# EAGLE design imu (EAGLE 9.5.0)
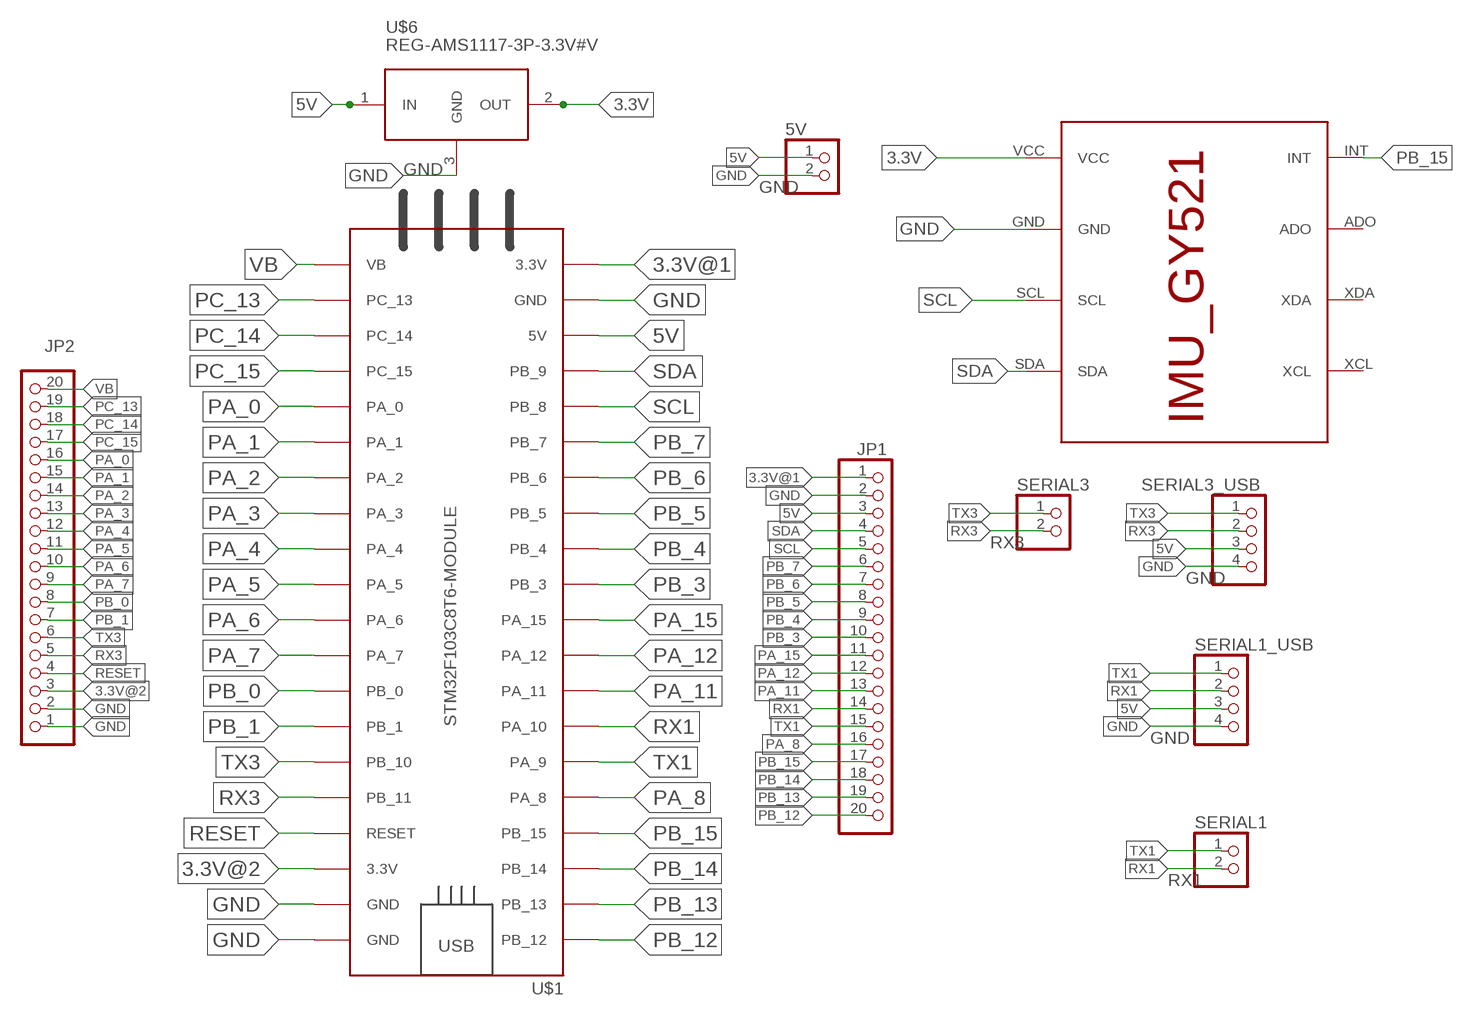
[diagram p0: schematic, sheet 1]

## Parts
5V  PINHD-2_DATA  [1X02_DATA]
JP1  PINHD-1X20  [1X20]
JP2  PINHD-1X20  [1X20]
SERIAL1  PINHD-2_DATA  [1X02_DATA]
SERIAL1_USB  PINHD-4_DATA  [1X04_DATA]
SERIAL3  PINHD-2_DATA  [1X02_DATA]
SERIAL3_USB  PINHD-4_DATA  [1X04_DATA]
U$1  STM32F103C8T6-MODULE  [STM32F103C8T6-MODULE]
U$2  IMU_ROBOCON_GY521  [IMU_GY521]
U$6  REG-AMS1117-3P-3.3V#V  [REG-AMS1117-3P#V]

## Nets
3.3V: U$2.VCC U$6.2(OUT)
3.3V@1: JP1.1 U$1.3.3V_1(3.3V)
3.3V@2: JP2.3 U$1.3.3V_2(3.3V)
5V: 5V.1 JP1.3 SERIAL1_USB.3 SERIAL3_USB.3 U$1.5V U$6.1(IN)
GND: 5V.2 JP1.2 JP2.1 JP2.2 SERIAL1_USB.4 SERIAL3_USB.4 U$1.GND_1(GND) U$1.GND_2(GND) U$1.GND_3(GND) U$2.GND U$6.3(GND)
PA_0: JP2.16 U$1.PA_0
PA_1: JP2.15 U$1.PA_1
PA_2: JP2.14 U$1.PA_2
PA_3: JP2.13 U$1.PA_3
PA_4: JP2.12 U$1.PA_4
PA_5: JP2.11 U$1.PA_5
PA_6: JP2.10 U$1.PA_6
PA_7: JP2.9 U$1.PA_7
PA_8: JP1.16 U$1.PA_8
PA_11: JP1.13 U$1.PA_11
PA_12: JP1.12 U$1.PA_12
PA_15: JP1.11 U$1.PA_15
PB_0: JP2.8 U$1.PB_0
PB_1: JP2.7 U$1.PB_1
PB_3: JP1.10 U$1.PB_3
PB_4: JP1.9 U$1.PB_4
PB_5: JP1.8 U$1.PB_5
PB_6: JP1.7 U$1.PB_6
PB_7: JP1.6 U$1.PB_7
PB_12: JP1.20 U$1.PB_12
PB_13: JP1.19 U$1.PB_13
PB_14: JP1.18 U$1.PB_14
PB_15: JP1.17 U$1.PB_15 U$2.INT
PC_13: JP2.19 U$1.PC_13
PC_14: JP2.18 U$1.PC_14
PC_15: JP2.17 U$1.PC_15
RESET: JP2.4 U$1.RESET
RX1: JP1.14 SERIAL1.2 SERIAL1_USB.2 U$1.PA_10
RX3: JP2.5 SERIAL3.2 SERIAL3_USB.2 U$1.PB_11
SCL: JP1.5 U$1.PB_8 U$2.SCL
SDA: JP1.4 U$1.PB_9 U$2.SDA
TX1: JP1.15 SERIAL1.1 SERIAL1_USB.1 U$1.PA_9
TX3: JP2.6 SERIAL3.1 SERIAL3_USB.1 U$1.PB_10
VB: JP2.20 U$1.VB
Unconnected: U$2.ADO U$2.XCL U$2.XDA

## Library data of the parts
5V SERIAL1 SERIAL3 = MIA_LIBRARY-2-2-2:PINHD-2_DATA: PIN HEADER
JP1 JP2 = MIA_LIBRARY-2-2-2:PINHD-1X20: PIN HEADER
SERIAL1_USB SERIAL3_USB = MIA_LIBRARY-2-2-2:PINHD-4_DATA: PIN HEADER
U$1 = MIA_LIBRARY-2-2-2:STM32F103C8T6-MODULE: STM32F103C8T6 module with ARM Cortex-3, 20kB SRAM, 64kB Flash, 72MHz
U$2 = MIA_LIBRARY-2-2-2:IMU_ROBOCON_GY521
U$6 = MIA_LIBRARY-2-2-2:REG-AMS1117-3P-*: Linear Regulator based on AMS1117 chip 3-pin version AMS1117 datasheet is available here: http://www.advanced-monolithic.com/pdf/ds1117.pdf Click here to find device on ebay.com <http://www.ebay.com/sch/ams1117+module> Note: There are many variants. Search for the proper version.

## Board
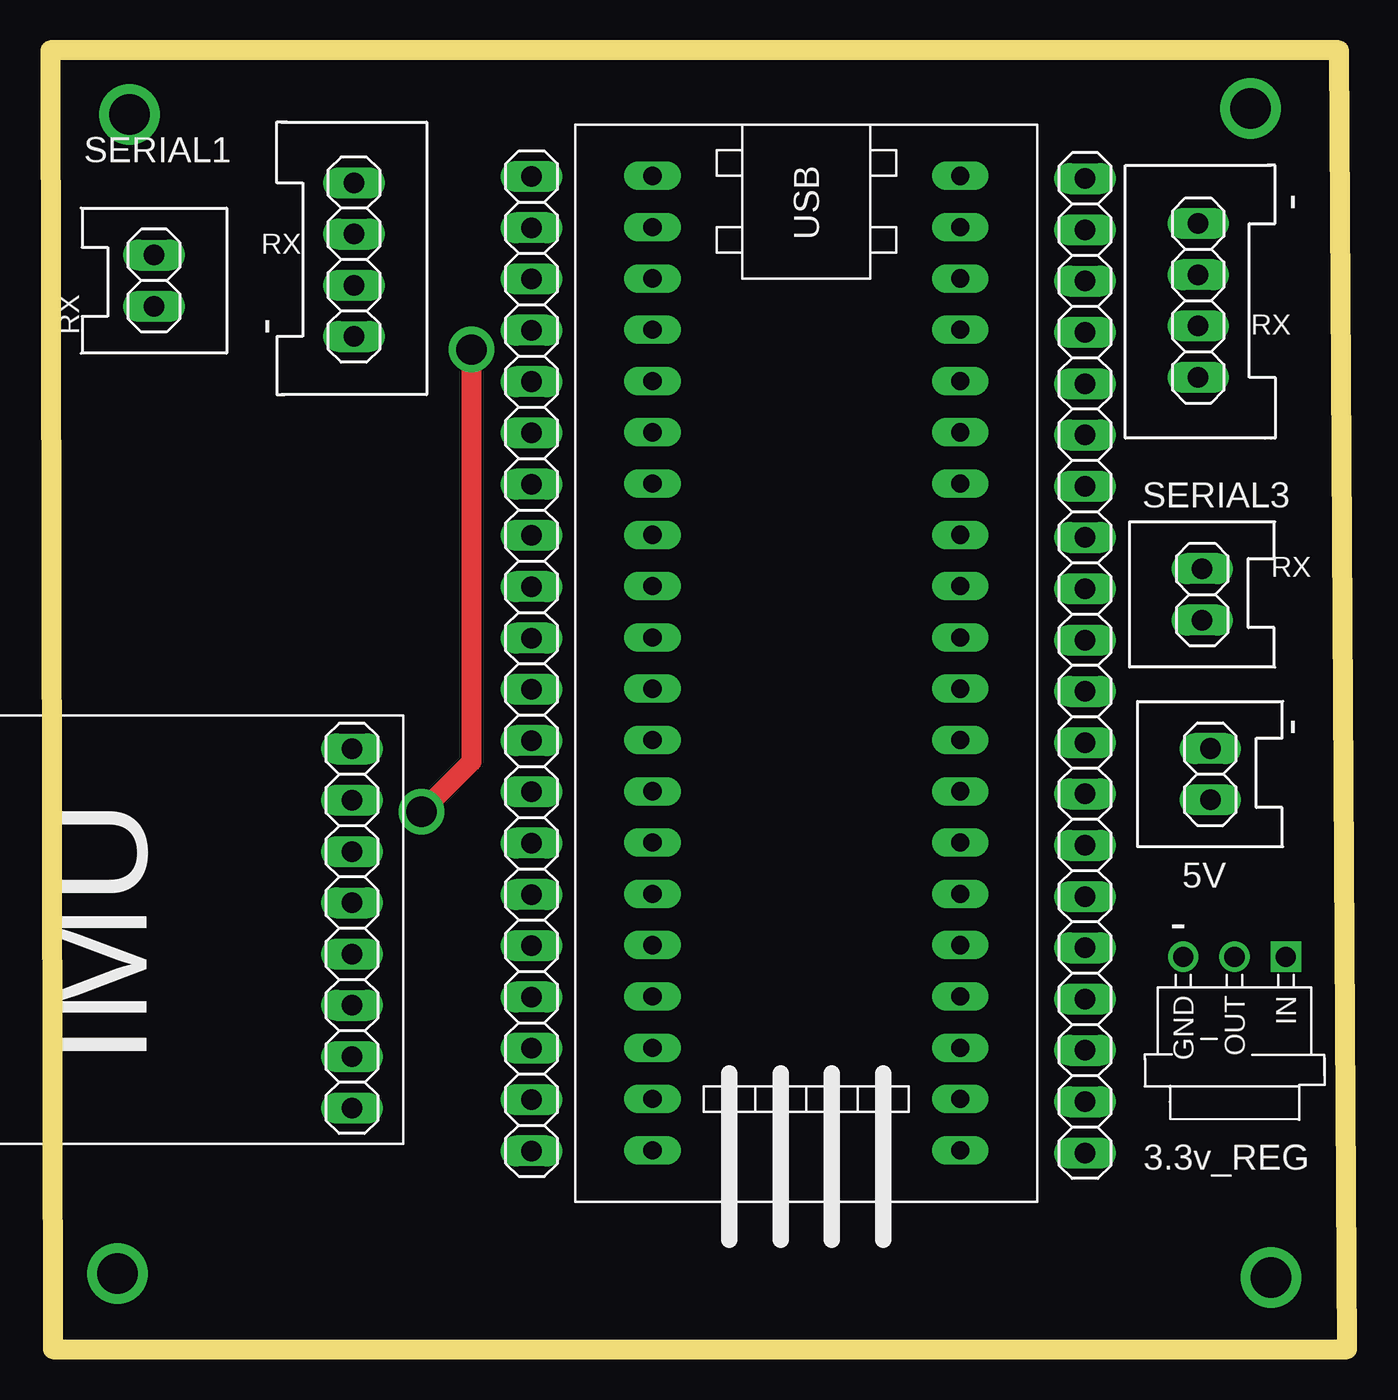
[diagram p1: board, top side]
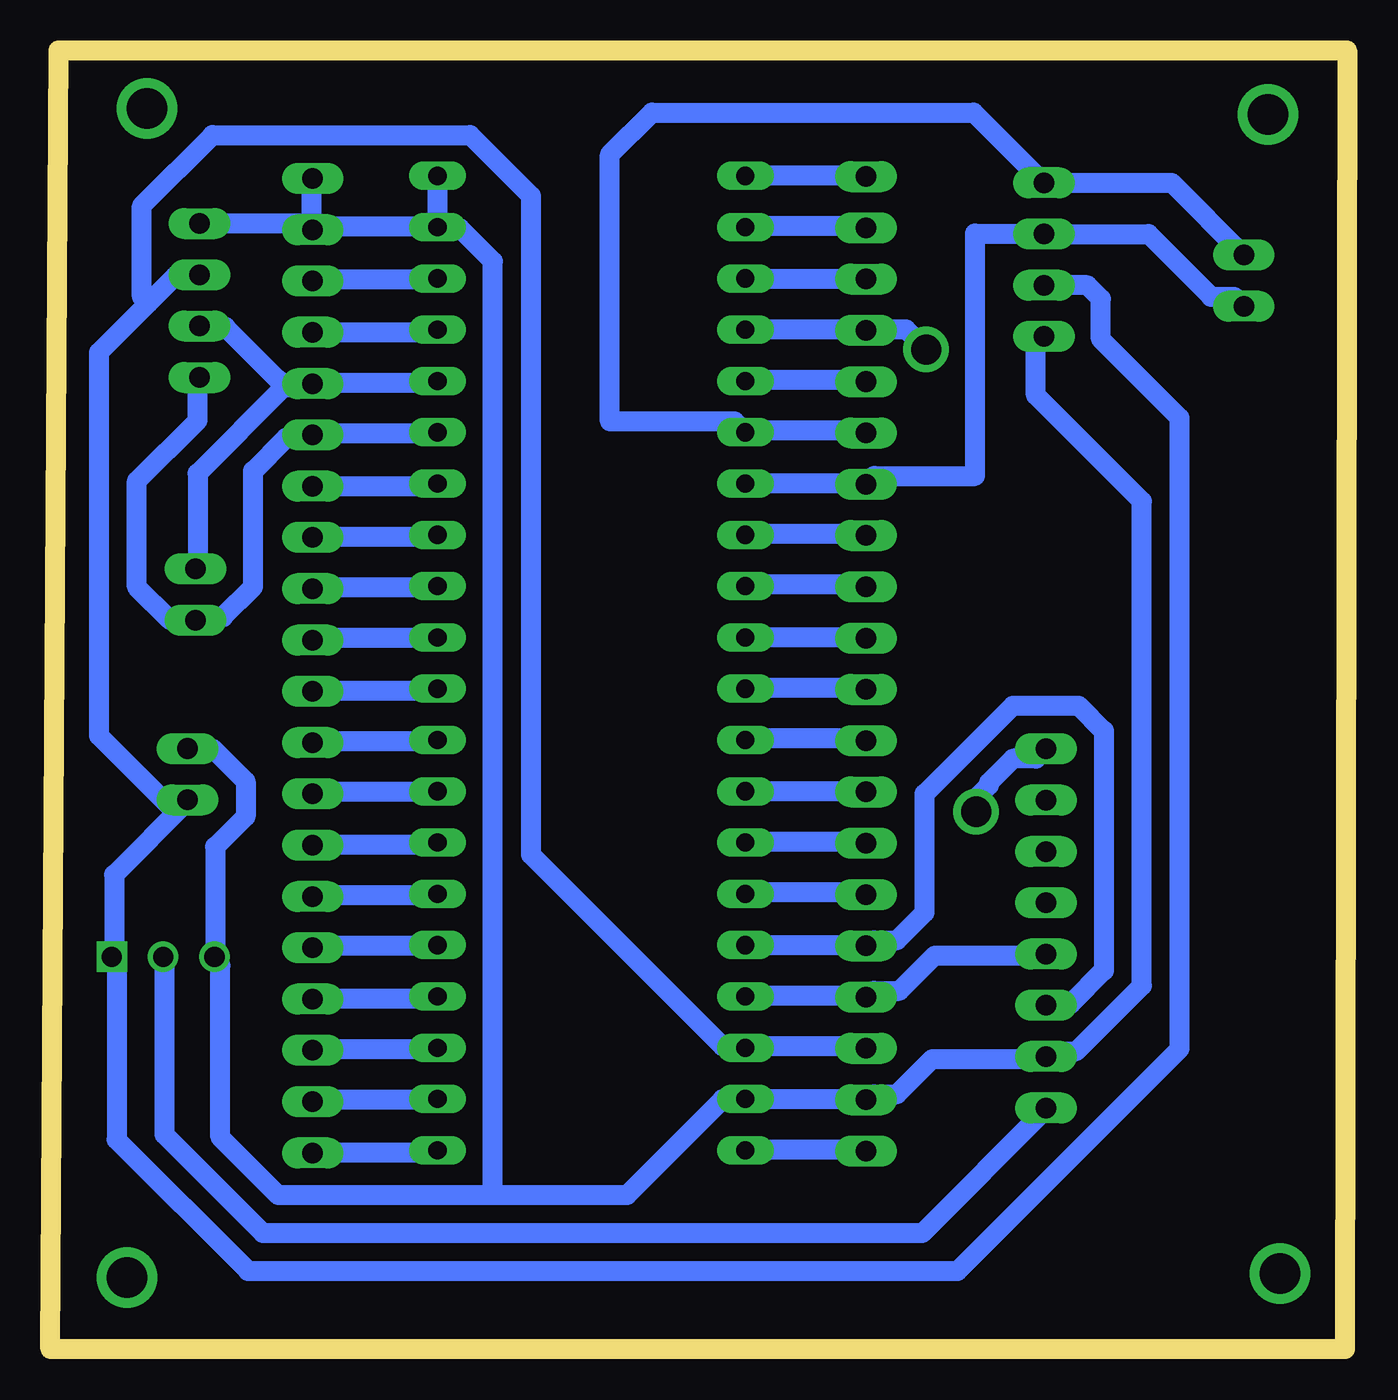
[diagram p2: board, bottom side, seen from below]

Size 64.2 x 64.31 mm. Coordinates in mm from the lower left corner, seen from the top.
Outline: 0.11,0 64.2,0 63.8,64.31 0,64.31 0.11,0
Copper layers (1*16): Top 0.035mm / dielectric 1.5mm / Bottom 0.035mm
Design rules "default *": minimum track width 1mm, minimum drill 0.35mm, track to track 0.8mm, track to pad 0.8mm, pad to pad 0.8mm, via to via 0.8mm, smd to smd 6mil, copper to edge 0.8mm, drill to drill 0.8mm, minimum pad ring 10mil, minimum via ring 8mil, stop-mask expansion 4mil, vias tented up to drill 0mil, thermal gap 10mil

### Footprints (pad centres in the part's own frame; a part is rotated, then mirrored left to right if it is on the bottom)
1X02_DATA = drill 1.016 long: 1 -1.27,0; 2 1.27,0
1X20 = drill 1.016 long: 1 -24.13,0; 2 -21.59,0; 3 -19.05,0; 4 -16.51,0; 5 -13.97,0; 6 -11.43,0; 7 -8.89,0; 8 -6.35,0; 9 -3.81,0; 10 -1.27,0; 11 1.27,0; 12 3.81,0; 13 6.35,0; 14 8.89,0; 15 11.43,0; 16 13.97,0; 17 16.51,0; 18 19.05,0; 19 21.59,0; 20 24.13,0
1X04_DATA = drill 1.016 long: 1 -3.81,0; 2 -1.27,0; 3 1.27,0; 4 3.81,0
STM32F103C8T6-MODULE = drill 0.9 long: 3.3V_1 25.4,-7.62; 3.3V_2 -17.78,7.62; 5V 20.32,-7.62; GND_1 22.86,-7.62; GND_2 -20.32,7.62; GND_3 -22.86,7.62; PA_0 15.24,7.62; PA_1 12.7,7.62; PA_2 10.16,7.62; PA_3 7.62,7.62; PA_4 5.08,7.62; PA_5 2.54,7.62; PA_6 0,7.62; PA_7 -2.54,7.62; PA_8 -12.7,-7.62; PA_9 -10.16,-7.62; PA_10 -7.62,-7.62; PA_11 -5.08,-7.62; PA_12 -2.54,-7.62; PA_15 0,-7.62; PB_0 -5.08,7.62; PB_1 -7.62,7.62; PB_3 2.54,-7.62; PB_4 5.08,-7.62; PB_5 7.62,-7.62; PB_6 10.16,-7.62; PB_7 12.7,-7.62; PB_8 15.24,-7.62; PB_9 17.78,-7.62; PB_10 -10.16,7.62; PB_11 -12.7,7.62; PB_12 -22.86,-7.62; PB_13 -20.32,-7.62; PB_14 -17.78,-7.62; PB_15 -15.24,-7.62; PC_13 22.86,7.62; PC_14 20.32,7.62; PC_15 17.78,7.62; RESET -15.24,7.62; VB 25.4,7.62
IMU_GY521 = drill 1.016 long: ADO -6.35,0; GND 6.35,0; INT -8.89,0; SCL 3.81,0; SDA 1.27,0; VCC 8.89,0; XCL -3.81,0; XDA -1.27,0
REG-AMS1117-3P#V = drill 1 square: 1 -2.54,-5.08 | drill 1: 2 0,-5.08; 3 2.54,-5.08

### Placement (x,y rotation side)
5V  57.42,28.47 90 top
JP1  23.82,33.94 90 top
JP2  51.22,33.84 270 top
SERIAL1  5.12,52.91 270 top
SERIAL1_USB  15.02,53.95 270 top
SERIAL3  57.02,37.37 90 top
SERIAL3_USB  56.82,51.93 90 top
U$1  37.42,35.24 270 top
U$2  14.92,20.83 270 top
U$6  58.62,14.34 180 top

### Tracks (layer width: path | path; a pad name or v marks a point on that pad's centre or on a via)
3.3V
  Bottom 1: U$6.2 58.55,19.37 58.55,10.62 53.67,5.74 21.05,5.74 14.92,11.87 U$2.VCC
3.3V@1
  Bottom 1: U$1.3.3V_1 29.8,9.87 23.92,9.87 JP1.1
3.3V@2
  Bottom 1: U$1.3.3V_2 45.05,52.99 51.17,52.99 JP2.3
5V
  Bottom 1: JP1.3 23.92,14.99 29.8,14.99 U$1.5V 30.3,14.99 30.92,14.99 40.42,24.49 40.42,57.12 43.42,60.12 56.17,60.12 59.67,56.62 59.67,52.12 59.36,51.8 | 59.36,51.8 61.8,49.37 61.8,30.37 58.3,26.87 5V.1 57.42,27.12 61.05,23.49 61.05,19.49 U$6.1 60.92,18.99 60.92,10.37 54.42,3.87 19.3,3.87 8.29,14.87 8.29,46.12 12.2,50.02 12.2,52.02 12.86,52.68 SERIAL1_USB.3 | 59.36,51.8 58.05,53.12 56.92,53.12 SERIAL3_USB.3
GND
  Bottom 1: U$1.GND_2 45.05,55.62 45.05,57.99 U$1.GND_3 | JP2.2 51.3,55.49 51.3,57.87 JP2.1 | SERIAL3_USB.4 51.67,55.74 JP2.2 | U$1.GND_2 45.55,55.62 50.8,55.62 JP2.2 | 5V.2 56.17,29.74 54.55,28.12 54.55,26.37 56.05,24.87 56.05,19.49 U$6.3 55.8,18.99 55.8,10.49 52.92,7.62 42.3,7.62 | 42.3,7.62 35.67,7.62 30.92,12.37 30.3,12.37 U$1.GND_1 29.8,12.37 23.92,12.37 JP1.2 23.42,12.62 22.3,12.62 20.55,14.37 14.92,14.37 U$2.GND 14.54,14.74 13.42,14.74 10.17,17.99 10.17,41.99 15.42,47.24 15.42,49.74 SERIAL1_USB.4 | 42.3,7.62 42.3,53.87 43.92,55.49 44.55,55.49 U$1.GND_2
N$1  (via drill 2 pad 3)
  other vias: 3.92,61.14
N$2  (via drill 2 pad 3)
  other vias: 59.42,61.44
N$3  (via drill 2 pad 3)
  other vias: 60.42,3.54
N$4  (via drill 2 pad 3)
  other vias: 3.32,3.74
PA_0
  Bottom 1: U$1.PA_0 51.17,19.99 JP2.16
PA_1
  Bottom 1: U$1.PA_1 45.05,22.49 51.17,22.49 JP2.15
PA_2
  Bottom 1: U$1.PA_2 45.05,24.99 51.17,24.99 JP2.14
PA_3
  Bottom 1: U$1.PA_3 51.05,27.62 51.17,27.49 JP2.13
PA_4
  Bottom 1: U$1.PA_4 45.05,30.12 51.17,30.12 JP2.12
PA_5
  Bottom 1: U$1.PA_5 45.05,32.62 51.17,32.62 JP2.11
PA_6
  Bottom 1: U$1.PA_6 51.05,35.24 51.17,35.12 JP2.10
PA_7
  Bottom 1: U$1.PA_7 45.05,37.74 51.17,37.74 JP2.9
PA_8
  Bottom 1: U$1.PA_8 29.8,47.99 23.92,47.99 JP1.16
PA_11
  Bottom 1: U$1.PA_11 29.8,40.37 23.92,40.37 JP1.13
PA_12
  Bottom 1: U$1.PA_12 29.8,37.87 23.92,37.87 JP1.12
PA_15
  Bottom 1: U$1.PA_15 23.92,35.24 JP1.11
PB_0
  Bottom 1: U$1.PB_0 45.05,40.24 51.17,40.24 JP2.8
PB_1
  Bottom 1: U$1.PB_1 45.05,42.74 51.17,42.74 JP2.7
PB_3
  Bottom 1: U$1.PB_3 29.8,32.74 23.92,32.74 JP1.10
PB_4
  Bottom 1: U$1.PB_4 29.8,30.24 23.92,30.24 JP1.9
PB_5
  Bottom 1: U$1.PB_5 23.92,27.62 JP1.8
PB_6
  Bottom 1: U$1.PB_6 29.8,25.12 23.92,25.12 JP1.7
PB_7
  Bottom 1: U$1.PB_7 29.8,22.62 23.92,22.62 JP1.6
PB_12
  Bottom 1: U$1.PB_12 29.8,58.12 23.92,58.12 JP1.20
PB_13
  Bottom 1: U$1.PB_13 29.8,55.62 23.92,55.62 JP1.19
PB_14
  Bottom 1: JP1.18 29.8,52.99 U$1.PB_14
PB_15  (via drill 1.5)
  Top 1: v18.37,26.61 20.84,29.09 v20.84,49.5
  Bottom 1: 23.92,50.49 U$1.PB_15 | 23.92,50.49 JP1.17 | U$2.INT 15.4,29.24 16.54,29.24 17.74,28.04 17.74,27.92 18.42,27.24 18.42,26.66 v18.37,26.61 | v20.84,49.5 21.84,50.49 23.92,50.49
PC_13
  Bottom 1: U$1.PC_13 45.05,12.37 51.17,12.37 JP2.19
PC_14
  Bottom 1: U$1.PC_14 45.05,14.87 51.17,14.87 JP2.18
PC_15
  Bottom 1: U$1.PC_15 45.05,17.37 51.17,17.37 JP2.17
RESET
  Bottom 1: U$1.RESET 45.05,50.37 51.17,50.37 JP2.4
RX1
  Bottom 1: 30.3,42.99 U$1.PA_10 23.92,42.87 JP1.14 23.41,43.24 18.42,43.24 18.42,55.24 15.04,55.24 SERIAL1_USB.2 9.84,55.22 6.74,52.12 5.6,52.12 SERIAL1.2
RX3
  Bottom 1: U$1.PB_11 45.05,47.87 51.17,47.87 JP2.5 51.67,47.62 52.67,47.62 | 52.67,47.62 56.92,43.37 56.92,38.74 SERIAL3.2 | SERIAL3_USB.2 56.8,50.62 55.55,50.62 52.92,47.99 52.67,47.62
SCL
  Bottom 1: U$1.PB_8 23.92,19.99 JP1.5 23.42,20.24 22.3,20.24 20.92,21.62 20.92,27.49 16.55,31.87 13.29,31.87 12.04,30.62 12.04,18.74 13.67,17.12 14.92,17.12 U$2.SCL
SDA
  Bottom 1: U$1.PB_9 29.8,17.49 23.92,17.49 JP1.4 23.42,17.74 22.17,17.74 20.42,19.49 14.92,19.49 U$2.SDA
TX1
  Bottom 1: 23.42,45.62 JP1.15 23.92,45.49 29.8,45.49 U$1.PA_9 30.34,45.94 36.51,45.94 36.51,59.15 34.42,61.24 18.5,61.24 SERIAL1_USB.1 8.7,57.76 SERIAL1.1
TX3
  Bottom 1: U$1.PB_10 45.05,45.37 51.17,45.37 JP2.6 51.67,45.12 52.55,45.12 54.17,43.49 54.17,37.74 55.67,36.24 56.55,36.24 SERIAL3.1 57.05,36.12 58.3,36.12 59.92,37.74 59.92,42.99 56.92,45.99 56.92,48.12 SERIAL3_USB.1
VB
  Bottom 1: U$1.VB 45.05,9.74 51.17,9.74 JP2.20

### Text on the board
tPlace: 3.3v_REG
tNames: - | RX | RX | - | RX | RX | - | -